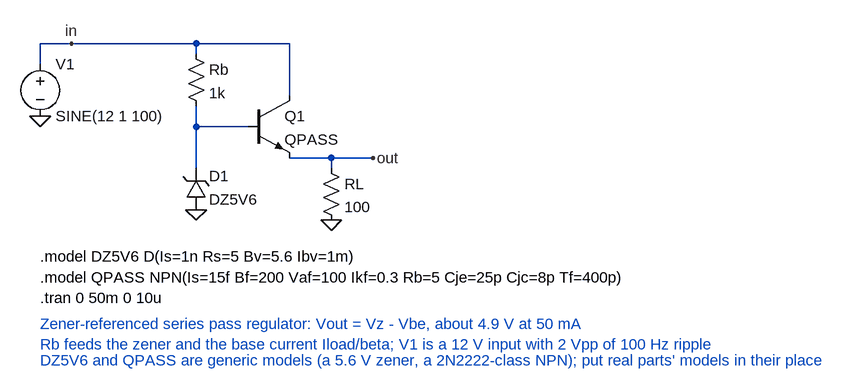
[diagram p0: schematic pass_regulator.asc]
pass_regulator.asc, the LTspice schematic file:
Version 4
SHEET 1 880 680
WIRE 32 64 32 96
WIRE 272 64 32 64
WIRE 416 64 272 64
WIRE 272 80 272 64
WIRE 416 144 416 64
WIRE 272 192 272 160
WIRE 352 192 272 192
WIRE 272 256 272 192
WIRE 480 240 416 240
WIRE 544 240 480 240
WIRE 480 256 480 240
FLAG 32 176 0
FLAG 272 320 0
FLAG 480 336 0
FLAG 80 64 in
FLAG 544 240 out
SYMBOL voltage 32 80 R0
SYMATTR InstName V1
SYMATTR Value SINE(12 1 100)
SYMBOL res 256 64 R0
SYMATTR InstName Rb
SYMATTR Value 1k
SYMBOL zener 256 320 M180
WINDOW 0 36 52 Left 2
WINDOW 3 36 16 Left 2
SYMATTR InstName D1
SYMATTR Value DZ5V6
SYMBOL npn 352 144 R0
SYMATTR InstName Q1
SYMATTR Value QPASS
SYMBOL res 464 240 R0
SYMATTR InstName RL
SYMATTR Value 100
TEXT 32 392 Left 2 !.model DZ5V6 D(Is=1n Rs=5 Bv=5.6 Ibv=1m)
TEXT 32 424 Left 2 !.model QPASS NPN(Is=15f Bf=200 Vaf=100 Ikf=0.3 Rb=5 Cje=25p Cjc=8p Tf=400p)
TEXT 32 456 Left 2 !.tran 0 50m 0 10u
TEXT 32 496 Left 2 ;Zener-referenced series pass regulator: Vout = Vz - Vbe, about 4.9 V at 50 mA\nRb feeds the zener and the base current Iload/beta; V1 is a 12 V input with 2 Vpp of 100 Hz ripple
TEXT 32 552 Left 2 ;DZ5V6 and QPASS are generic models (a 5.6 V zener, a 2N2222-class NPN); put real parts' models in their place

The netlist it stands for:
* pass_regulator.asc
V1 in 0 SINE(12 1 100)
Rb in N001 1k
D1 0 N001 DZ5V6
Q1 in N001 out 0 QPASS
RL out 0 100
.model D D
.lib standard.dio
.model NPN NPN
.model PNP PNP
.lib standard.bjt
.model DZ5V6 D(Is=1n Rs=5 Bv=5.6 Ibv=1m)
.model QPASS NPN(Is=15f Bf=200 Vaf=100 Ikf=0.3 Rb=5 Cje=25p Cjc=8p Tf=400p)
.tran 0 50m 0 10u
* Zener-referenced series pass regulator: Vout = Vz - Vbe, about 4.9 V at 50 mA
* Rb feeds the zener and the base current Iload/beta; V1 is a 12 V input with 2 Vpp of 100 Hz ripple
* DZ5V6 and QPASS are generic models (a 5.6 V zener, a 2N2222-class NPN); put real parts' models in their place
.backanno
.end